# EAGLE design DS2482 1 Wire Controller copy (EAGLE 7.1.0)
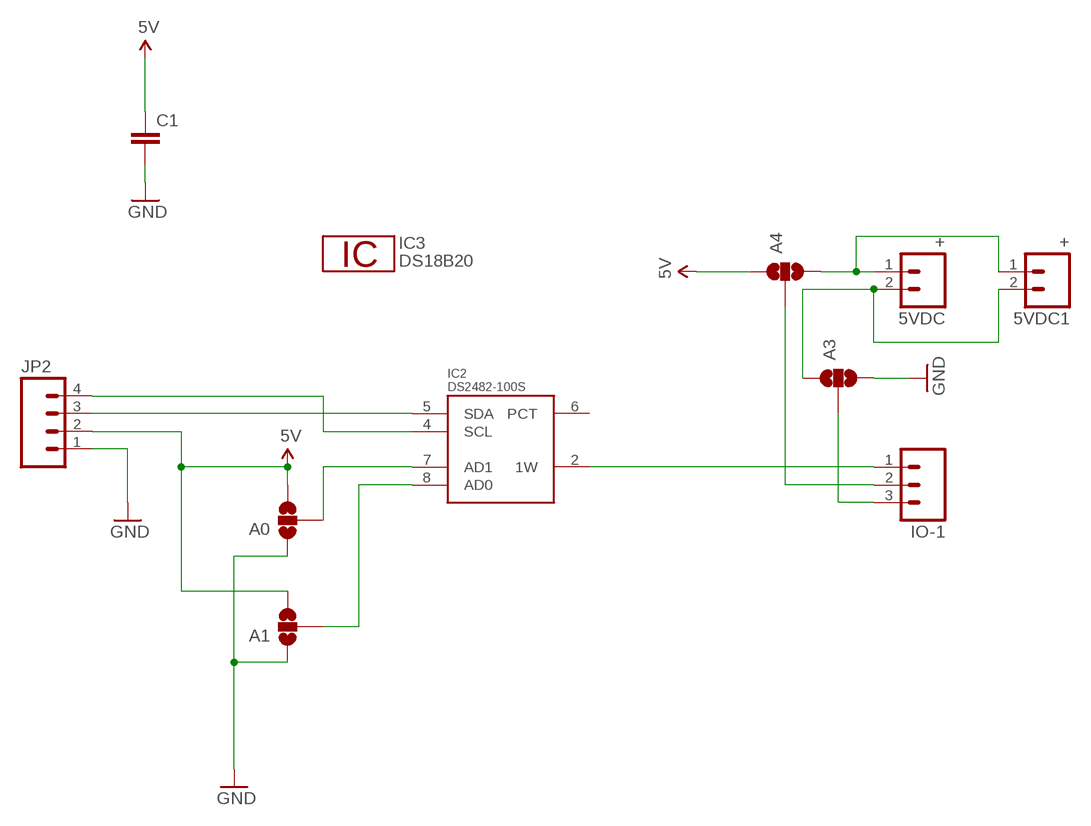
[diagram p0: schematic, sheet 1]

## Parts
5VDC  +  M02PTH  [1X02]
5VDC1  +  M02PTH  [1X02]
A0  SOLDERJUMPER_2WAYS  [SJ_3]
A1  SOLDERJUMPER_2WAYS  [SJ_3]
A3  SOLDERJUMPER_2WAYS  [SJ_3]
A4  SOLDERJUMPER_2WAYS  [SJ_3]
C1  CAPPTH2  [CAP-PTH-SMALL2]
IC2  DS2482-100S  [SO08]
IC3  DS18B20  [TO92-]
IO-1  M03PTH  [1X03]
JP2  M04PTH  [1X04]

## Nets
5V: A0.3 A1.3 A4.1 C1.1 JP2.2
GND: A0.1 A1.1 A3.3 C1.2 JP2.1
N$1: IC2.2(1W) IO-1.1
N$2: IC2.4(SCL) JP2.4
N$4: A0.2 IC2.7(AD1)
N$5: IC2.5(SDA) JP2.3
N$6: A3.2 IO-1.3
N$7: A1.2 IC2.8(AD0)
N$19: A4.2 IO-1.2
N$20: 5VDC1.1 5VDC.1 A4.3
N$21: 5VDC1.2 5VDC.2 A3.1
Unconnected: IC2.6(PCT)

## Power pins joined to a net without a drawn wire
1W: IC3.2
GND: IC2.3(GND) IC3.1
VDD: IC2.1(VDD) IC3.3

## Library data of the parts
5VDC 5VDC1 = SparkFun-Connectors:M02: Standard 2-pin 0.1" header. Use with - straight break away headers ( PRT-00116) - right angle break away headers (PRT-00553) - swiss pins (PRT-00743) - machine pins (PRT-00117) - female headers (PRT-00115) Molex polarized connector foot print use with: PRT-08233 with associated crimp pins and housings. 2.54_SCREWTERM for use with PRT-10571. 3.5mm Screw Terminal footprints for PRT-08084 5mm Screw Terminal footprints for use with PRT-08432
A0 A1 A3 A4 = SparkFun-Retired:SOLDERJUMPER_2WAY: Solder Jumper 2 way solder jumper
C1 = SparkFun-Capacitors:CAP: Capacitor Standard 0603 ceramic capacitor, and 0.1" leaded capacitor.
IC2 = 1wire:DS2482-100: I2C to 1-Wire Host Adapter/Line Driver This device is a onewire host and I2C interface in one chip. It provides the complete DC/AC requirements for onewire communication, including overdrive speed mode, but, unlike the DS2480B chip, no 12V EPROM programming. Notes: For overdrive speed and 5V EEPROM programming, an external active pullup circuit must be connected to the 1W, VDD and PCT pin. See the datasheet for details. The lower two I2C adress bits of the chip can be selected by external pins, so up to 4 chips may be connected to the same I2C bus. Author: Orginal device and description from Giovanni Varasano <giovanni.varasano@fastwebnet.it> Improved by Jan Kandziora <jjj@gmx.de>
IC3 = 1wire:DS18B20: Programmable Resolution Digital Thermometer This chip provides a onewire thermosensor with approx. 0.5°C accuracy. A programmable over/undertemperure alarm is available. The precision can be set from 9..12 bits. Notes: Vdd must be applied for accurate measurements at low temperatures, as the parasite power circuit otherwise heats the sensor. If parasite power is used, Vdd has to be connected to GND. The DS1822 is a low-cost thermometer chip, the DS18S20 is similar to the DS18B20, but with 9 Bit precision only. Author: Jan Kandziora <jjj@gmx.de>
IO-1 = SparkFun-Connectors:M03: Header 3 Standard 3-pin 0.1" header. Use with straight break away headers (SKU : PRT-00116), right angle break away headers (PRT-00553), swiss pins (PRT-00743), machine pins (PRT-00117), and female headers (PRT-00115). Molex polarized connector foot print use with SKU : PRT-08232 with associated crimp pins and housings.
JP2 = SparkFun-Connectors:M04: Header 4 Standard 4-pin 0.1" header. Use with straight break away headers (SKU : PRT-00116), right angle break away headers (PRT-00553), swiss pins (PRT-00743), machine pins (PRT-00117), and female headers (PRT-00115). Molex polarized connector foot print use with SKU : PRT-08231 with associated crimp pins and housings. 1MM SMD Version SKU: PRT-10208

## Board
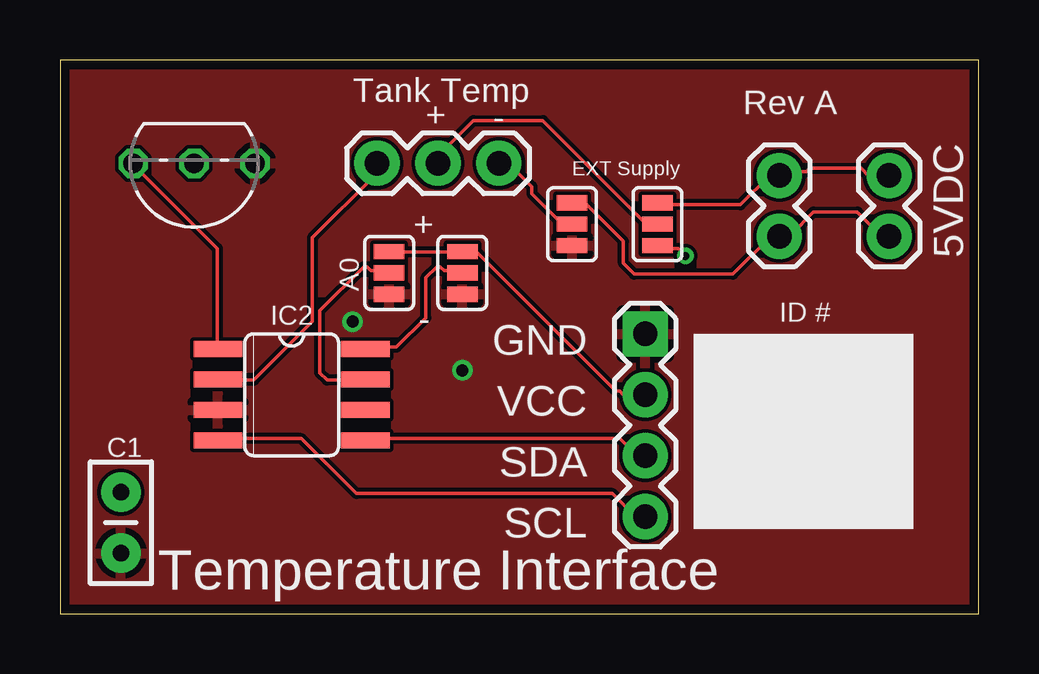
[diagram p1: board, top side]
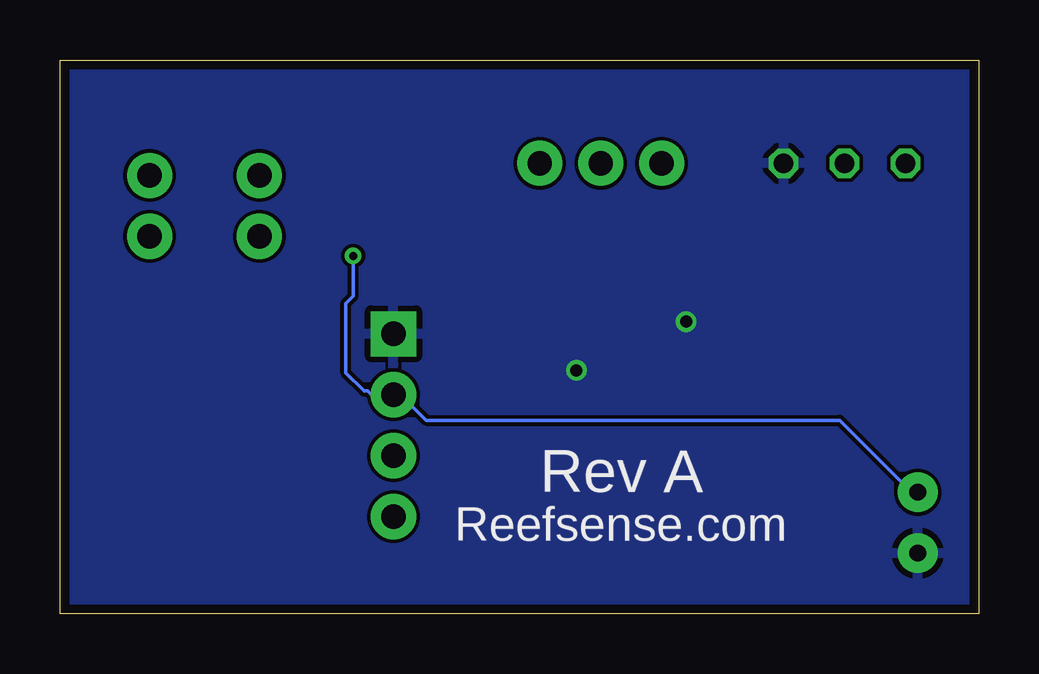
[diagram p2: board, bottom side, seen from below]

Size 38.28 x 23.1 mm. Coordinates in mm from the lower left corner, seen from the top.
Outline: 0,0 38.28,0 38.28,23.1 0,23.1 0,0
Copper layers (1*16): Top 0.0356mm / dielectric 1.5011mm / Bottom 0.0356mm
Design rules "LaenPCBOrder": minimum track width 6mil, minimum drill 13mil, track to track 6mil, track to pad 6mil, pad to pad 6mil, via to via 6mil, smd to smd 6mil, copper to edge 15mil, drill to drill 6mil, minimum pad ring 7mil, minimum via ring 7mil, stop-mask expansion 3mil, vias tented up to drill 0mil, thermal gap 10mil

### Footprints (pad centres in the part's own frame; a part is rotated, then mirrored left to right if it is on the bottom)
1X02 = drill 1.016 pad 1.88: 1 0,0; 2 2.54,0
SJ_3 = smd 0.635 x 1.27: 1 -0.889,0; 2 0,0; 3 0.889,0
CAP-PTH-SMALL2 = drill 0.7 pad 1.651: 1 0,0; 2 2.54,0
SO08 = smd 0.66 x 2.032: 1 -1.905,-3.073; 2 -0.635,-3.073; 3 0.635,-3.073; 4 1.905,-3.073; 5 1.905,3.073; 6 0.635,3.073; 7 -0.635,3.073; 8 -1.905,3.073
TO92- = drill 0.813 octagon: 1 -2.54,0; 2 0,0; 3 2.54,0
1X03 = drill 1.016 pad 1.88: 1 0,0; 2 2.54,0; 3 5.08,0
1X04 = drill 1.016 pad 1.88 square: 1 0,0 | drill 1.016 pad 1.88: 2 2.54,0; 3 5.08,0; 4 7.62,0

### Placement (x,y rotation side)
5VDC  34.54,18.29 270 top
5VDC1  29.97,18.29 270 top
A0  13.72,14.22 90 top
A1  16.76,14.22 90 top
A3  21.34,16.26 270 top
A4  24.89,16.26 90 top
C1  2.54,5.08 270 top
IC2  9.65,9.14 270 top
IC3  5.59,18.8 180 top
IO-1  13.21,18.8 0 top
JP2  24.38,11.68 270 top

### Tracks (layer width: path | path; a pad name or v marks a point on that pad's centre or on a via)
5V  (via drill 0.33)
  Top 0.152: 16.76,15.09 13.72,15.09 A0.3 | v26.06,14.94 25.76,15.24 24.99,15.24 A4.1 | 16.76,15.09 17.37,15.09 23.16,9.3 23.32,9.3 23.47,9.14 JP2.2 | 16.76,15.09 A1.3
  Bottom 0.152: v26.06,14.94 26.06,13.26 26.36,12.95 26.36,10.06 25.6,9.3 25.45,9.3 25.3,9.14 JP2.2 24.08,9.14 23.01,8.08 5.79,8.08 2.9,5.18 2.59,5.18 C1.1
GND  (via drill 0.5)
  other vias: 12.19,12.19 16.76,10.16
  pour Top: -2.03,38.61 59.44,38.61 59.94,-1.52 -1.02,-1.02
  pour Bottom: -1.02,-1.02 60.96,-2.03 60.45,37.59 -1.52,37.08
N$1
  Top 0.152: IC2.2 6.71,9.75 8.08,9.75 10.52,12.19 10.52,15.7 13.11,18.29 13.11,18.75 IO-1.1
N$2
  Top 0.152: IC2.4 6.71,7.32 10.06,7.32 12.34,5.03 23.01,5.03 23.93,4.12 24.38,4.12 JP2.4
N$4
  Top 0.152: A0.2 13.72,14.33 12.95,14.33 12.8,14.48 12.65,14.48 10.82,12.65 10.82,10.06 11.12,9.75 12.65,9.75 IC2.7
N$5
  Top 0.152: IC2.5 12.8,7.32 23.32,7.32 23.93,6.71 24.38,6.71 JP2.3
N$6
  Top 0.152: A3.2 21.34,16.31 20.88,16.31 19.66,17.53 19.66,17.83 18.75,18.75 18.29,18.75 IO-1.3
N$7
  Top 0.152: A1.2 16.76,14.33 16,14.33 15.85,14.48 15.7,14.48 15.24,14.02 15.24,12.34 14.02,11.12 12.8,11.12 IC2.8
N$19
  Top 0.152: A4.2 24.84,16.31 24.38,16.31 20.12,20.57 17.22,20.57 15.85,19.2 15.85,18.9 IO-1.2
N$20
  Top 0.152: A4.3 24.99,17.07 28.35,17.07 29.57,18.29 5VDC1.1 30.02,18.29 30.18,18.44 31.09,18.44 31.24,18.59 33.38,18.59 33.68,18.29 5VDC.1
N$21
  Top 0.152: A3.1 21.34,17.07 21.95,17.07 23.47,15.54 23.47,14.63 23.93,14.17 28.04,14.17 29.57,15.7 29.87,15.7 5VDC1.2 30.02,15.85 30.48,15.85 31.39,16.76 33.22,16.76 34.14,15.85 34.44,15.85 5VDC.2
VDD
  Top 0.152: IC2.1 6.55,11.12 6.55,15.24 3.05,18.75 IC3.3

### Text on the board
tNames: Tank Temp | Rev A | + | - | EXT Supply | + | - | GND | ID # | VCC | SDA | SCL | Temperature Interface
bNames: Rev A | Reefsense.com